# EAGLE design emonTH V1.4 (EAGLE 6.5.0)
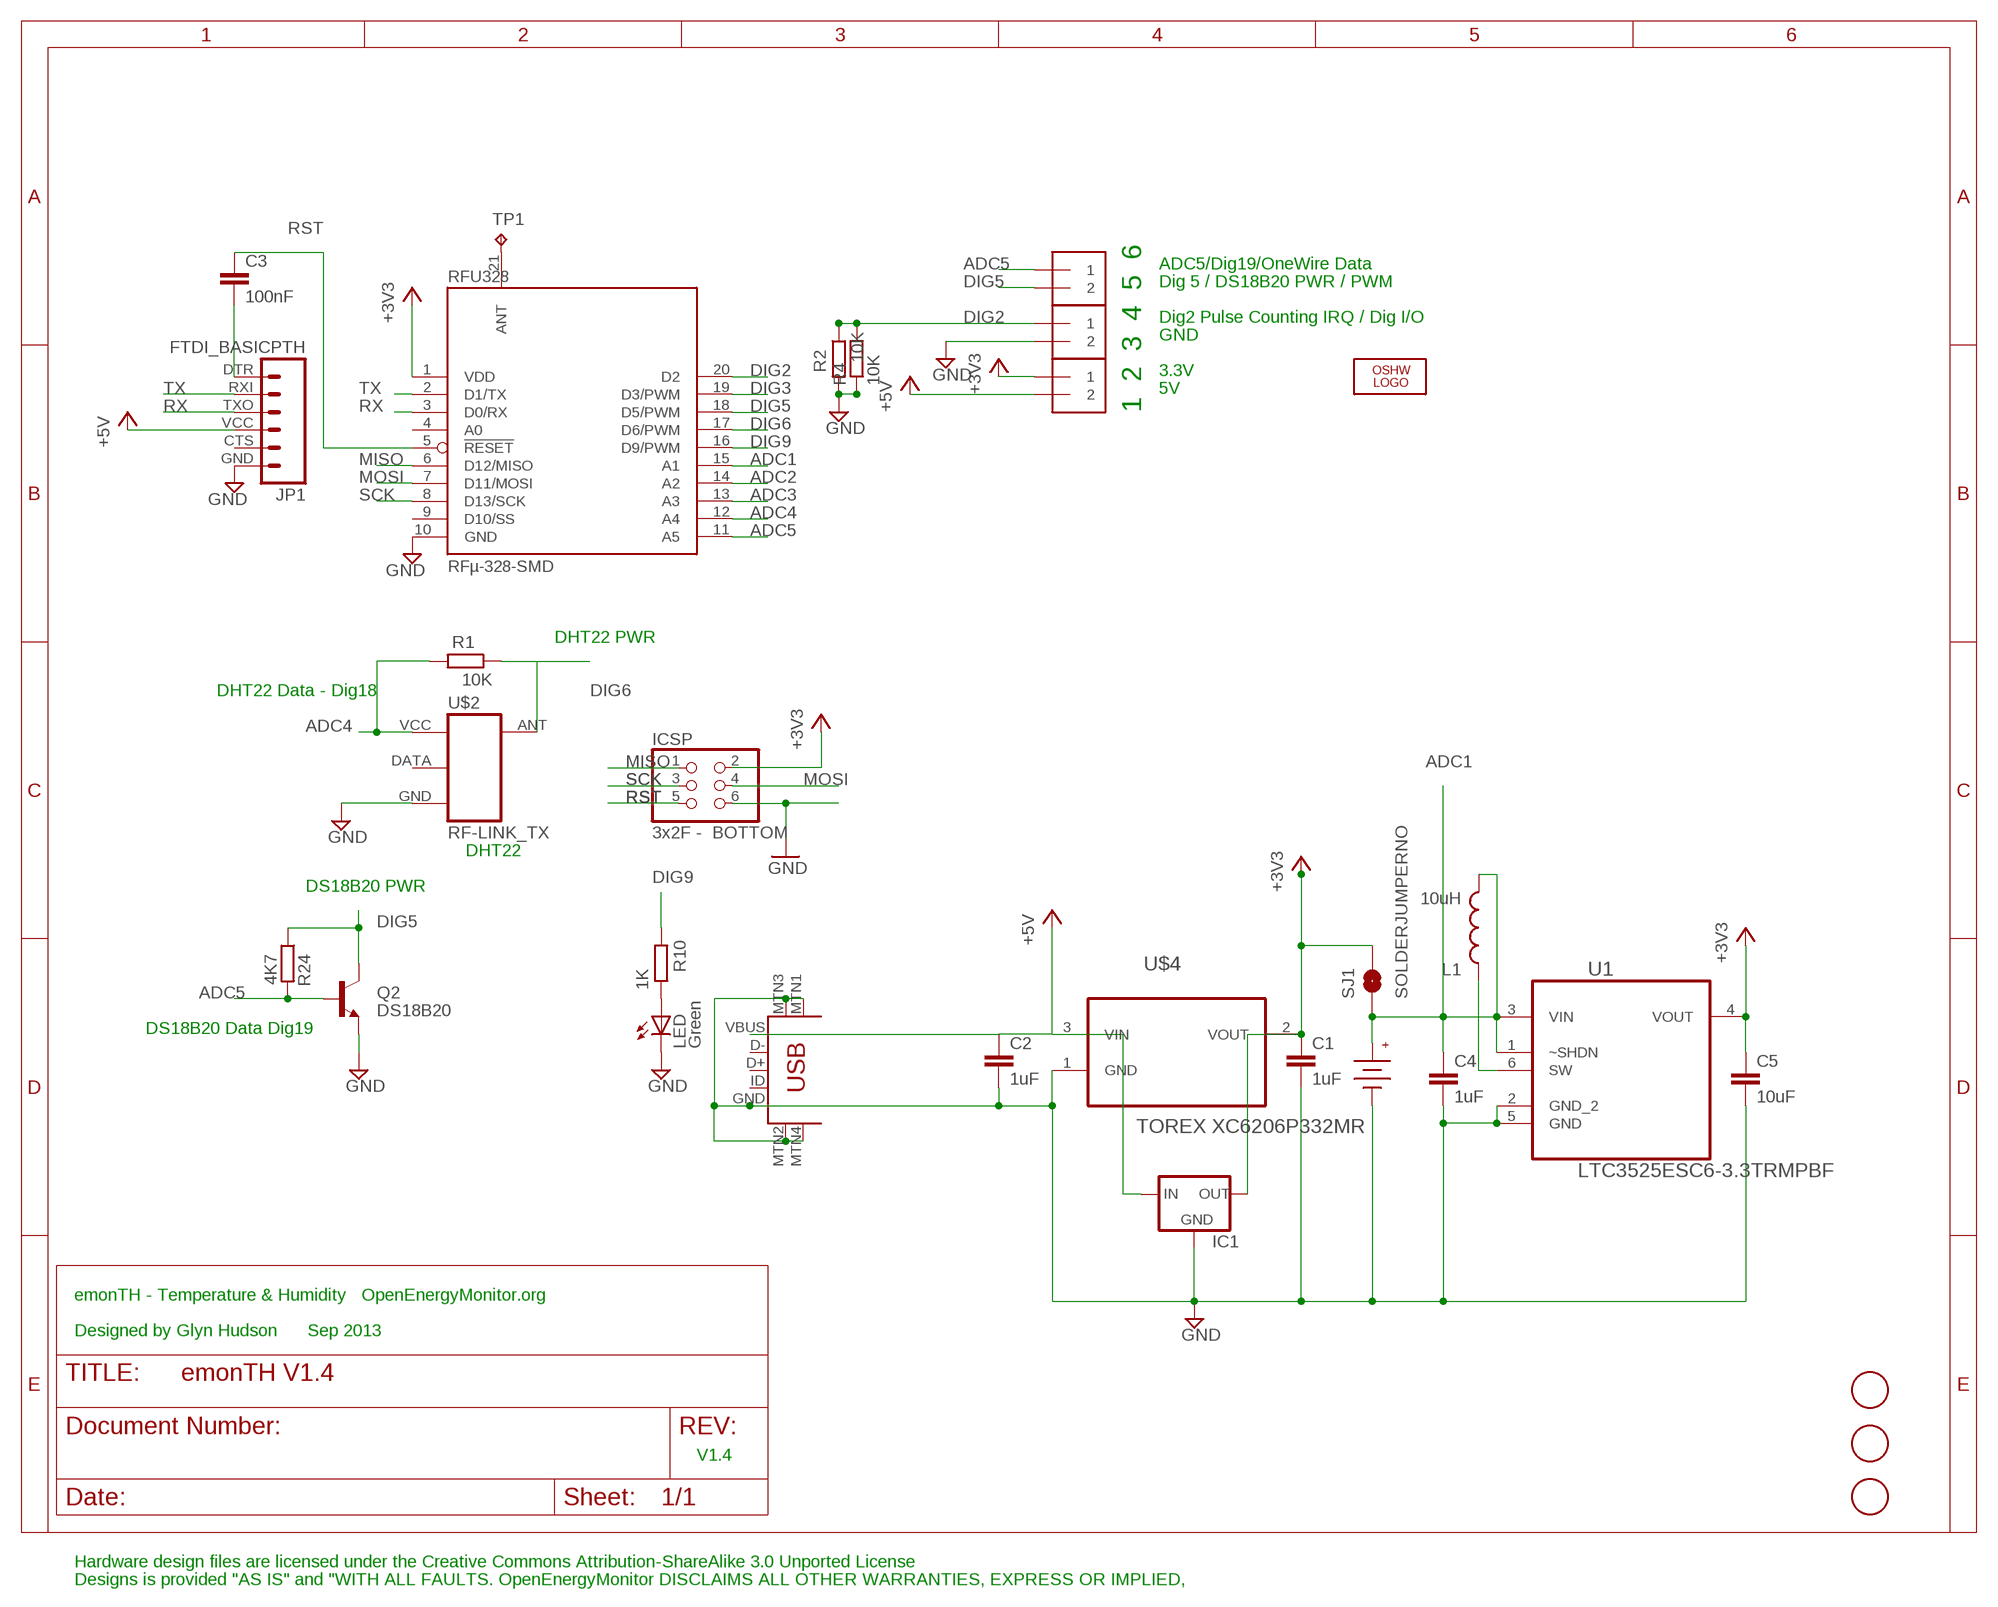
[diagram p0: schematic, sheet 1]

## Parts
C1  1uF  C-EUC0603  [C0603]
C2  1uF  C-EUC0603  [C0603]
C3  100nF  C-EUC0603  [C0603]
C4  1uF  C-EUC0603  [C0603]
C5  10uF  C-EUC0603  [C0603]
IC1  78XXS  [78XXS]
ICSP  3x2F - BOTTOM  PINHD-2X3  [2X03]
J1  1X2-3.5MM  [1X2-3.5MM]
J2  1X2-3.5MM  [1X2-3.5MM]
J3  1X2-3.5MM  [1X2-3.5MM]
JP1  FTDI_BASICPTH  [FTDI_BASIC]
L1  10uH  INDUCTOR1210  [1210]
LED  Green  LEDCHIP-LED0805  [CHIP-LED0805]
LOGO1  OSHW_LOGO_10MILX0200-NT  [OSHW_10X200_NOTEXT]
Q2  DS18B20  TRANSISTOR_NPNTO92  [TO-92]
R1  10K  R-EU_R0603  [R0603]
R2  10K  R-EU_R0603  [R0603]
R4  10K  R-EU_0204/7  [0204/7]
R10  1K  R-EU_R0603  [R0603]
R24  4K7  R-EU_R0603  [R0603]
RFU328  RFµ-328-SMD  [RFµ-328-LANDING]
SJ1  SOLDERJUMPERNO  [SJ_2S-NO]
TP1  TPPAD1-20  [P1-20]
U1  LTC3525ESC6-3.3TRMPBF  [SOT65P210X100-6N]
U$1  FIDUCIAL  [FIDUCIAL_1MM]
U$2  RF-LINK_TX  [RF-LINK_TX]
U$3  3V  3X_AAA_BATTERY_HOLDER  [AAA_PCB_HOLDER]
U$4  TOREX XC6206P332MR  MCP1700T-3302E/TT  [SOT95P237X112-3N]
U$5  USB-MINIB-5PIN  [USB-MINIB-CISECO]
U$6  FIDUCIAL  [FIDUCIAL_1MM]
U$7  FIDUCIAL  [FIDUCIAL_1MM]

## Nets
+3V3: C1.1 C5.1 IC1.OUT ICSP.2 J3.1 RFU328.1(VDD) SJ1.2 U1.4(VOUT) U$4.2(VOUT)
+5V [power]: C2.1 IC1.IN J3.2 JP1.VCC U$4.3(VIN) U$5.VBUS
ADC1: C4.1 L1.2 RFU328.15(A1) SJ1.1 U1.1(~SHDN) U1.3(VIN) U$3.+
ADC2: RFU328.14(A2)
ADC3: RFU328.13(A3)
ADC4: R1.2 RFU328.12(A4) U$2.VCC(+5V)
ADC5: J1.1 Q2.2(B) R24.2 RFU328.11(A5)
DIG2: J2.1 R2.1 R4.2 RFU328.20(D2)
DIG3: RFU328.19(D3/PWM)
DIG5: J1.2 Q2.3(C) R24.1 RFU328.18(D5/PWM)
DIG6: R1.1 RFU328.17(D6/PWM) U$2.ANT
DIG9: R10.2 RFU328.16(D9/PWM)
GND [gnd]: C1.2 C2.2 C4.2 C5.2 IC1.GND ICSP.6 J2.2 JP1.GND LED.C Q2.1(E) R2.2 R4.1 RFU328.10(GND) U1.2(GND_2) U1.5(GND) U$2.GND U$3.- U$4.1(GND) U$5.GND U$5.MTN1(MTN2) U$5.MTN2(MTN3) U$5.MTN3(MTN1) U$5.MTN4
MISO: ICSP.1 RFU328.6(D12/MISO)
MOSI: ICSP.4 RFU328.7(D11/MOSI)
N$1: RFU328.21(ANT) TP1.TP
N$2: C3.2 JP1.DTR
N$5: L1.1 U1.6(SW)
N$41: LED.A R10.1
RST: C3.1 ICSP.5 RFU328.5(!RESET)
RX: JP1.TXO RFU328.3(D0/RX)
SCK: ICSP.3 RFU328.8(D13/SCK)
TX: JP1.RXI RFU328.2(D1/TX)
Unconnected: JP1.CTS RFU328.4(A0) RFU328.9(D10/SS) U$2.DATA U$5.D+ U$5.D- U$5.ID

## Notes on the sheet
- ADC5/Dig19/OneWire Data
- Dig 5 / DS18B20 PWR / PWM
- Dig2 Pulse Counting IRQ / Dig I/O
- GND
- 3.3V
- 5V
- 1  2  3  4  5  6
- DHT22 PWR
- DHT22 Data - Dig18
- DHT22
- DS18B20 PWR
- DS18B20 Data Dig19
- emonTH - Temperature & Humidity   OpenEnergyMonitor.org
- Designed by Glyn Hudson      Sep 2013
- V1.4
- Hardware design files are licensed under the Creative Commons Attribution-ShareAlike 3.0 Unported License
- Designs is provided "AS IS" and "WITH ALL FAULTS. OpenEnergyMonitor DISCLAIMS ALL OTHER WARRANTIES, EXPRESS OR IMPLIED,

## Library data of the parts
C1-C5 = resistor:C-EU: CAPACITOR, European symbol
IC1 = v-reg:78XXS: VOLTAGE REGULATOR
ICSP = pinhead:PINHD-2X3: PIN HEADER
J1-J3 = adafruit:1X2: 3.5mm Terminal block http://www.ladyada.net/library/pcb/eaglelibrary.html
JP1 = SparkFun:FTDI_BASIC: FTDI Basic: 3.3V and 5V
L1 = SparkFun:INDUCTOR: Inductors Basic Inductor/Choke - 0603 and 1206. Footprints are not proven and vary greatly between part numbers.
LED = adafruit:LED: LED OSRAM: - CHIPLED LG R971, LG N971, LY N971, LG Q971, LY Q971, LO R971, LY R971 LH N974, LH R974 LS Q976, LO Q976, LY Q976 LO Q996 - Hyper CHIPLED LW Q18S LB Q993, LB Q99A, LB R99A - SideLED LS A670, LO A670, LY A670, LG A670, LP A670 LB A673, LV A673, LT A673, LW A673 LH A674 LY A675 LS A676, LA A676, LO A676, LY A676, LW A676 LS A679, LY A679, LG A679 - Hyper Micro SIDELED® LS Y876, LA Y876, LO Y876, LY Y876 LT Y87S - SmartLED LW L88C, LW L88S LB L89C, LB L89S, LG L890 LS L89K, LO L89K, LY L89K LS L896, LA L896, LO L896, LY L896 - TOPLED LS T670, LO T670, LY T670, LG T670, LP T670 LSG T670, LSP T670, LSY T670, LOP T670, LYG T670 LG T671, LOG T671, LSG T671 LB T673, LV T673, LT T673, LW T673 LH T674 LS T676, LA T676, LO T676, LY T676, LB T676, LH T676, LSB T676, LW T676 LB T67C, LV T67C, LT T67C, LS T67K, LO T67K, LY T67K, LW E67C LS E67B, LA E67B, LO E67B, LY E67B, LB E67C, LV E67C, LT E67C LW T67C LS T679, LY T679, LG T679 LS T770, LO T770, LY T770, LG T770, LP T770 LB T773, LV T773, LT T773, LW T773 LH T774 LS E675, LA E675, LY E675, LS T675 LS T776, LA T776, LO T776, LY T776, LB T776 LHGB T686 LT T68C, LB T68C - Hyper Mini TOPLED® LB M676 - Mini TOPLED Santana® LG M470 LS M47K, LO M47K, LY M47K Source: http://www.osram.convergy.de/
LOGO1 = ohw-logo:OSHW_LOGO_10MIL
Q2 = SparkFun:TRANSISTOR_NPN: Transistor NPN BJT configuration in SOT23 package. MMBT2222 is the common NPN we use. Double check BCE configuration again layout.
R1 R2 R10 R24 = resistor:R-EU_: RESISTOR, European symbol
R4 = rcl:R-EU_: RESISTOR, European symbol
RFU328 = Ciseco Footprints:RFµ-328-SMD
SJ1 = SparkFun:SOLDERJUMPER: Solder Jumper Standard SMD solder jumper. Used to automate production. Two varients : Normally Open and Normally Closed are the same, but have different paste layers. NC will have a large amount of paste and should jumper during reflow.
TP1 = testpad:TP: Test pad
U1 = LTC3525:LTC3525ESC6-3.3TRMPBF: Step-Up DC/DC Converter; MPN: LTC3525ESC6-3.3#TRMPBF; OC_FARNELL: 1663904; OC_NEWARK: 19P0692; PACKAGE: SC70-6; SUPPLIER: LINEAR TECHNOLOGY
U$1 U$6 U$7 = adafruit:FIDUCIAL: For use by pick and place machines to calibrate the vision/machine, 1mm By microbuilder.eu
U$2 = SparkFun:RF-LINK_TX
U$3 = Battery Holders_2xAA:3X_AAA_BATTERY_HOLDER: 2x AA Battery Holder; RAPID_OC: 18-2967
U$4 = Farnell_MCP1700-SOT23:MCP1700T-3302E/TT: Low Quiescent Current LDO; MPN: MCP1700T-3302E/TT; OC_FARNELL: 1296592; OC_NEWARK: 88H9817; PACKAGE: SOT23-3; SUPPLIER: Microchip
U$5 = Ciseco USB miniB_Updated:USB-MINIB: Mini-USB "B" connector with 5th pin broken out. Created new symbol breaking out 5th "ID" pin in mini/micro USB connector spec. See: http://en.wikipedia.org/wiki/Mini_usb#Cables. Uses same footprint as 4-pin symbol. Also added pins to connect to mounting / shield pads if required (probably not generally needed as signals aren't shielded once they leave the connector). Modified by Ciseco for Rapid Part 24-0357

## Net classes
0 default: width 0.203 mm, drill 0.6 mm, clearance 0.203 mm
1 power: width 0.305 mm, drill 0.6 mm, clearance 0.254 mm
2 gnd: width 0.254 mm, drill 0.6 mm, clearance 0.254 mm

## Board
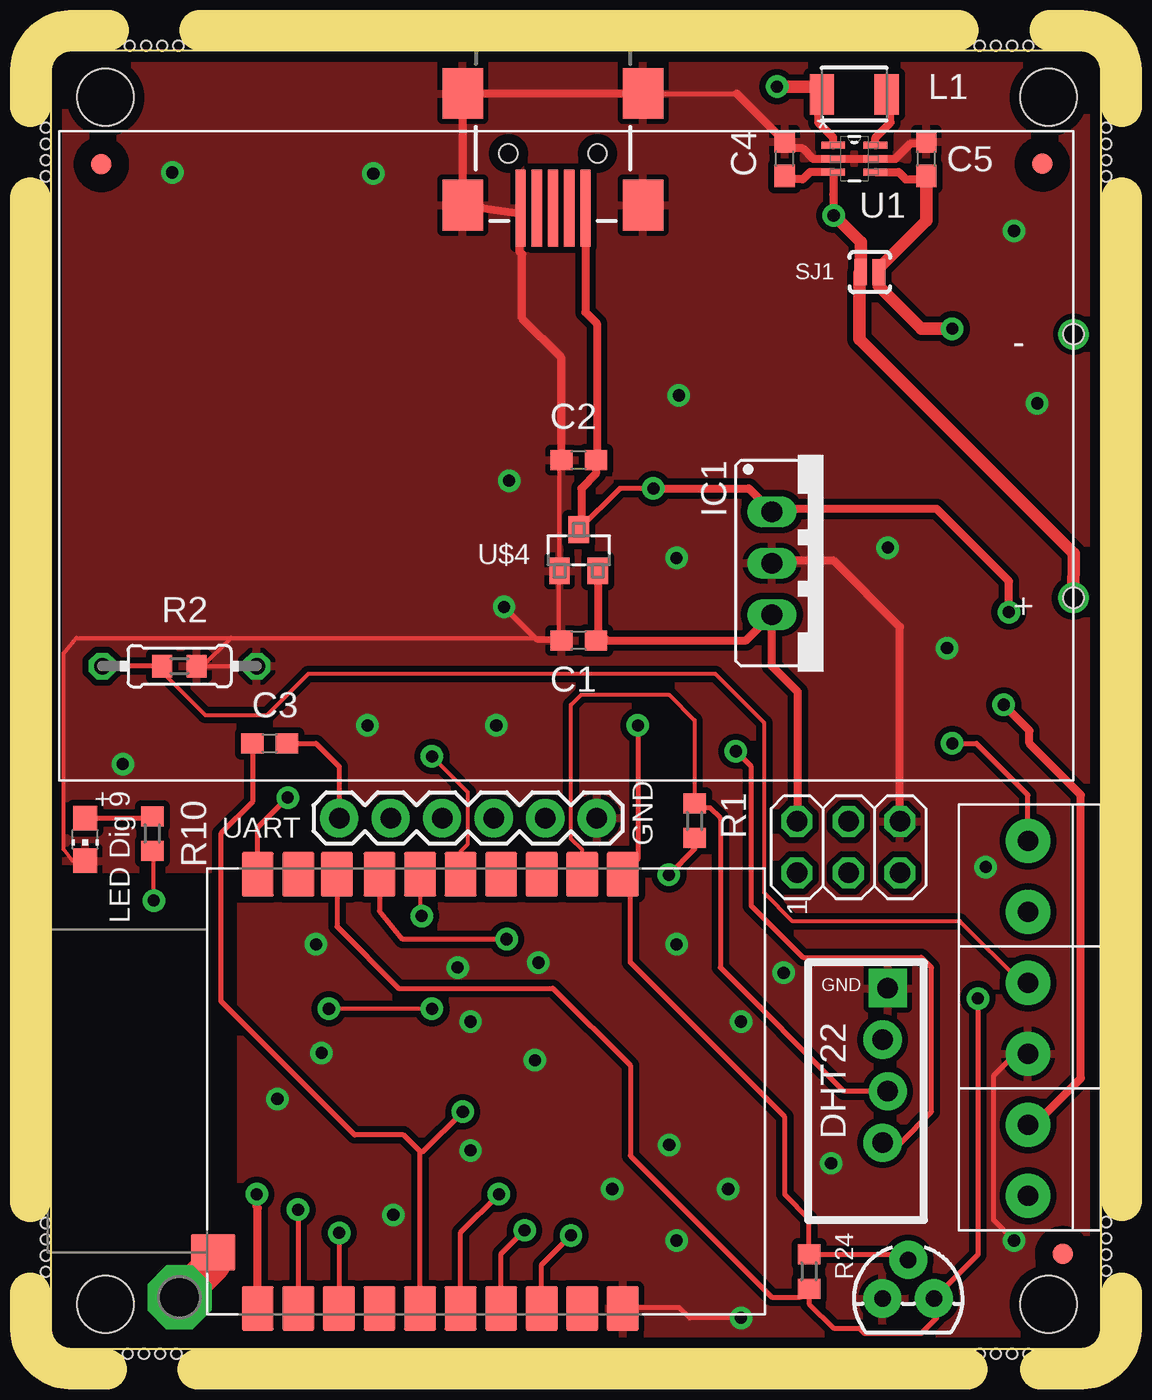
[diagram p1: board, top side]
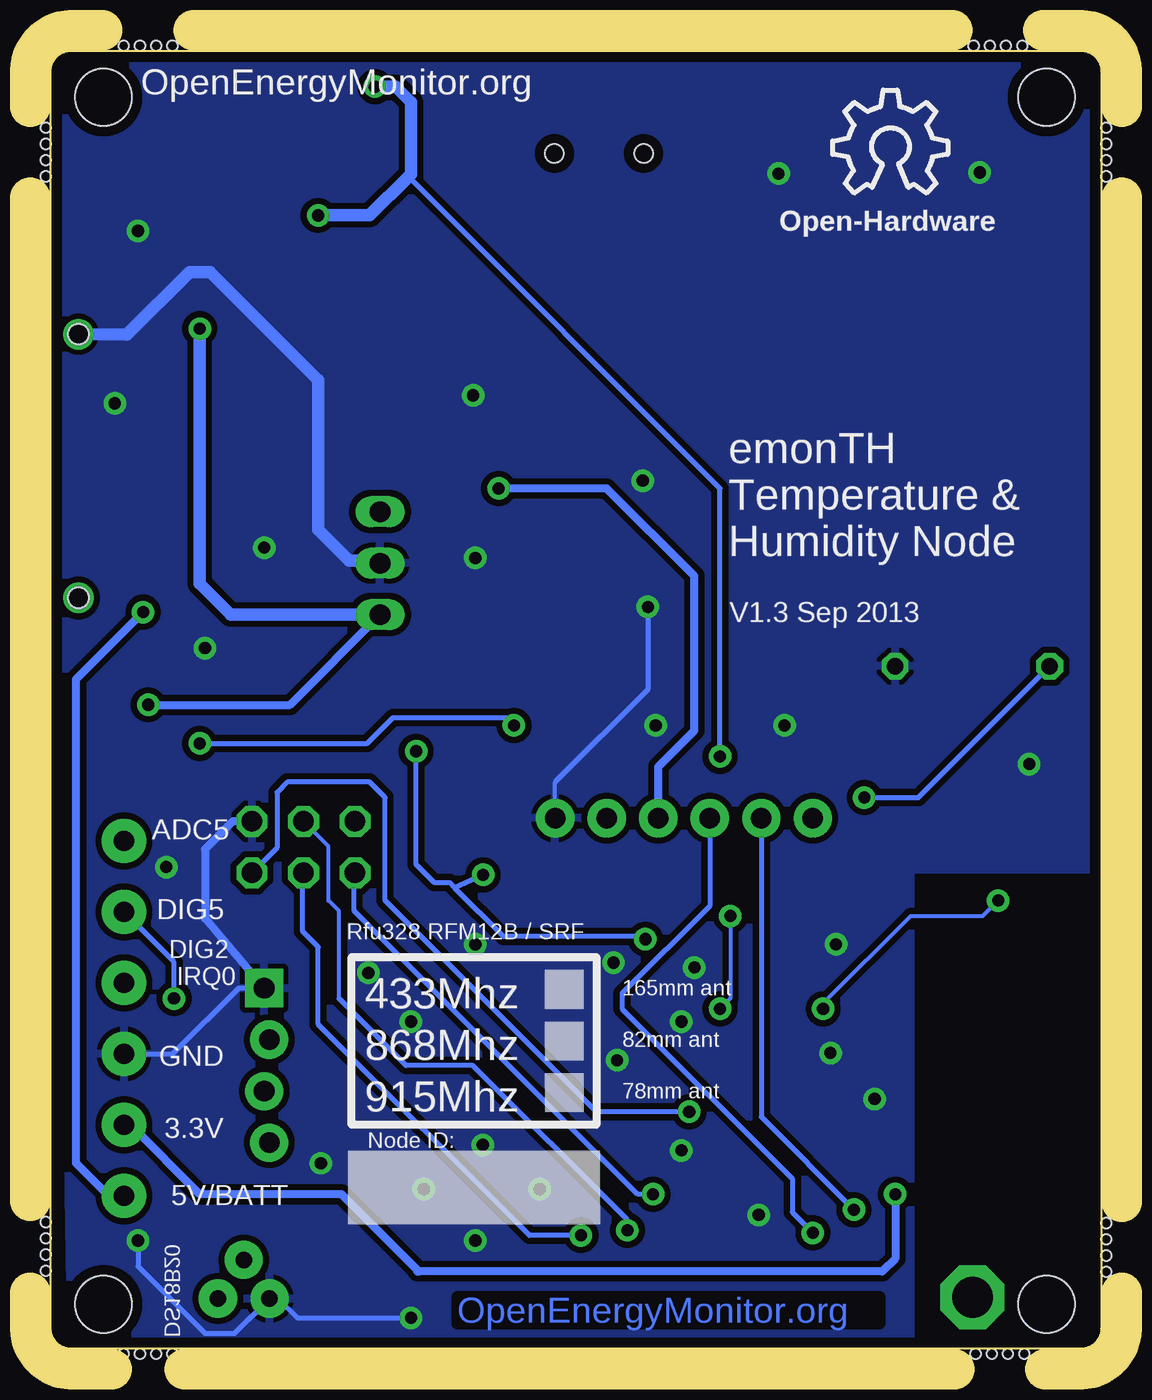
[diagram p2: board, bottom side, seen from below]

Size 51.8 x 64 mm. Coordinates in mm from the lower left corner, seen from the top.
Outline: 50.8,64 1,64 arc90 0,63 0,1 arc90 1,0 50.8,0 arc90 51.8,1 51.8,63 arc90 50.8,64
Copper layers (1*16): Top 0.035mm / dielectric 1.5mm / Bottom 0.035mm
Design rules "default": minimum track width 8mil, minimum drill 0.6mm, track to track 8mil, track to pad 10mil, pad to pad 10mil, via to via 10mil, smd to smd 10mil, copper to edge 20mil, drill to drill 16mil, minimum pad ring 10mil, minimum via ring 10mil, stop-mask expansion 0.075mm, vias tented up to drill 0.6mm, thermal gap 10mil
Holes 2.8 mm at 2.7,2.2 2.7,61.7 49.2,61.7 49.2,2.2
Holes 0.5 mm at 3.9,64.25 4.7,64.25 5.5,64.25 6.3,64.25 45.8,64.25 46.6,64.25 48.2,64.25 47.4,64.25 52.05,57.8 52.05,58.6 52.05,60.2 52.05,59.4 -0.25,57.8 -0.25,58.6 -0.25,60.2 -0.25,59.4 45.8,-0.25 46.6,-0.25 47.4,-0.25 48.2,-0.25 3.8,-0.25 4.6,-0.25 5.4,-0.25 6.2,-0.25 -0.25,3.8 -0.25,4.6 -0.25,5.4 -0.25,6.2 52.05,3.85 52.05,4.65 52.05,5.45 52.05,6.25
Milling: 16 lines

### Footprints (pad centres in the part's own frame; a part is rotated, then mirrored left to right if it is on the bottom)
C0603 = smd 1.1 x 1: 1 -0.85,0; 2 0.85,0
78XXS = drill 1.016 long: GND 0,-2.54; IN -2.54,-2.54; OUT 2.54,-2.54
2X03 = drill 1.016 octagon: 1 -2.54,-1.27; 2 -2.54,1.27; 3 0,-1.27; 4 0,1.27; 5 2.54,-1.27; 6 2.54,1.27
1X2-3.5MM = drill 1 pad 2.184: 1 1.8,0; 2 -1.7,0
FTDI_BASIC = drill 1.016 pad 1.88: CTS 10.16,0; DTR 0,0; GND 12.7,0; RXI 2.54,0; TXO 5.08,0; VCC 7.62,0
1210 = smd 1.2 x 2: 1 -1.6,0; 2 1.6,0
CHIP-LED0805 = smd 1.2 x 1.2: A 0,-1.05; C 0,1.05
TO-92 = drill 0.813 pad 1.88: 1 -1.27,0; 2 0,1.905; 3 1.27,0
R0603 = smd 1 x 1.1: 1 -0.85,0; 2 0.85,0
0204/7 = drill 0.813 octagon: 1 -3.81,0; 2 3.81,0
RFµ-328-LANDING = smd 2.2 x 1.6: 1 -10.7,20; 2 -10.7,18; 3 -10.7,16; 4 -10.7,14; 5 -10.7,12; 6 -10.7,10; 7 -10.7,8; 8 -10.7,6; 9 -10.7,4; 10 -10.7,2; 11 10.7,2; 12 10.7,4; 13 10.7,6; 14 10.7,8; 15 10.7,10; 16 10.7,12; 17 10.7,14; 18 10.7,16.1; 19 10.7,18; 20 10.7,20 | smd 1.8 x 2.2: 21 -7.93,22.2
SJ_2S-NO = smd 0.635 x 1.27: 1 -0.45,0; 2 0.45,0
P1-20 = drill 2.007 pad 3.15 octagon: TP 0,0
SOT65P210X100-6N = smd 1.168 x 0.356: 1 -1.041,0.66; 2 -1.041,0; 3 -1.041,-0.66; 4 1.041,-0.66; 5 1.041,0; 6 1.041,0.66
FIDUCIAL_1MM = smd 1 x 1: 1 0,0
RF-LINK_TX = drill 1.016 pad 1.88: ANT 7.62,-0.127; DATA 2.54,-0.127; VCC 5.08,0.127 | drill 1.016 pad 1.88 square: GND 0,0.127
AAA_PCB_HOLDER = drill 1: + 0,9; - 0,22 | hole 1: 0,9; 0,22
SOT95P237X112-3N = smd 0.991 x 1.321: 1 -0.94,-1.016; 2 0.94,-1.016; 3 0,1.016
USB-MINIB-CISECO = smd 3.8 x 0.5: D+ 7.9,0; D- 7.9,0.8; GND 7.9,-1.6; ID 7.9,-0.8; VBUS 7.9,1.6 | smd 2.5 x 2: MTN1 2.25,4.45; MTN2 7.75,4.45; MTN3 2.25,-4.45; MTN4 7.75,-4.45 | hole 0.9: 5.2,2.2; 5.2,-2.2

### Placement (x,y rotation side)
C1  26.04,34.92 180 top
C2  26.04,43.81 180 top
C3  10.79,29.84 0 top
C4  36.2,58.67 90 top
C5  43.18,58.67 90 top
IC1  38.1,38.73 270 top
ICSP  39.34,24.74 0 top
J1  48.18,23.24 90 top
J2  48.18,16.24 90 top
J3  48.18,9.24 90 top
JP1  14.22,26.16 0 top
L1  39.62,61.85 180 top
LED  1.7,25.11 180 top
LOGO1  13.23,56.98 0 bottom
Q2  42.28,2.48 0 top
R1  31.75,26.04 90 top
R2  6.35,33.66 0 top
R4  6.35,33.66 180 top
R10  5.01,25.4 270 top
R24  37.4,3.81 90 top
RFU328  30.21,12.69 90 top
SJ1  40.39,53.09 0 top
TP1  6.35,2.54 0 top
U1  39.62,58.67 0 top
U$1  49.9,4.68 0 top
U$2  41.15,17.78 270 top
U$3  50.43,28.02 0 top
U$4  26.04,39.37 0 top
U$5  24.77,64.14 270 top
U$6  2.5,58.4 0 top
U$7  48.9,58.42 0 top

### Tracks (layer width: path | path; a pad name or v marks a point on that pad's centre or on a via)
+3V3  (via drill 0.6)
  Top 0.254: 36.83,26.04 ICSP.2 | 43.01,57.66 C5.1 | SJ1.2 40.84,53.28
  Top 0.406: C1.1 27.43,34.92 | 27.43,34.92 34.29,34.92 IC1.OUT 35.56,33.66 36.83,32.38 36.83,26.04 | U$4.2 26.98,35.38 27.43,34.92 | v46.99,31.75 48.26,30.48 48.26,29.84 50.8,27.3 50.8,13.34 48.5,11.04 J3.1 | RFU328.1 10.21,6.93 10.16,6.99 v10.16,7.62 | U1.4 41.81,58.01 42.16,57.66 43.01,57.66
  Top 0.61: 40.84,53.28 43.18,55.63 C5.1 | SJ1.2 40.84,52.38 42.93,50.29 v44.45,50.29
  Bottom 0.406: v10.16,7.62 10.16,4.45 10.79,3.81 33.72,3.81 33.72,3.87 | 33.66,3.81 33.72,3.87 | 33.72,3.87 37.47,7.62 44.45,7.62 47.87,11.04 J3.1 | v46.99,31.75 40.01,31.75 IC1.OUT
  Bottom 0.61: IC1.OUT 42.93,36.2 44.45,37.72 v44.45,50.29
+5V  (via drill 0.6)
  Top 0.254: v29.72,42.42 28.07,42.42 U$4.3
  Top 0.406: U$5.VBUS 26.36,51.1 26.92,50.55 26.92,43.85 C2.1 26.89,43.14 26.16,42.42 26.16,40.51 U$4.3 | v47.24,36.32 47.24,37.85 43.69,41.4 35.69,41.4 IC1.IN 34.42,42.42 v29.72,42.42
  Bottom 0.406: JP1.VCC 21.84,28.7 20.07,30.48 20.07,38.1 24.38,42.42 v29.72,42.42 | J3.2 48.94,7.54 50.55,9.14 50.55,33.02 v47.24,36.32
ADC1  (via drill 0.6)
  Top 0.203: RFU328.15 20.21,24.53 20.57,24.89 20.57,27.43 v18.8,29.21
  Top 0.254: U1.1 38.46,59.33 | 37.85,61.16 37.59,61.42 L1.2 37.64,62.23 | 36.36,57.66 C4.1
  Top 0.406: U1.1 38.58,59.72 37.85,60.45 37.85,61.16 | 36.36,57.66 37.08,57.66 37.44,58.01 U1.3 38.58,56.92 v38.61,55.88
  Top 0.61: v35.81,62.23 37.64,62.23 | v38.61,55.88 39.94,54.55 SJ1.1 39.88,53.03 39.88,49.78 50.45,39.21 U$3.+
  Bottom 0.254: v18.8,29.21 18.8,42.42 34.16,57.78
  Bottom 0.61: v35.81,62.23 34.8,62.23 34.04,61.47 34.04,57.91 34.16,57.78 36.07,55.88 v38.61,55.88
ADC4
  Top 0.203: RFU328.12 26.21,24.59 25.65,25.15 25.65,31.75 26.16,32.26 30.48,32.26 31.75,30.99 R1.2
  Top 0.254: U$2.VCC 39.12,12.7 33.02,18.8 33.02,26.16 32.51,26.67 31.96,26.67 R1.2
ADC5  (via drill 0.6)
  Top 0.254: v28.96,30.73 28.96,24.14 RFU328.11 28.57,23.03 28.57,19.05 36.2,11.43 36.2,7.62 37.4,6.42 R24.2 42,4.66 Q2.2 | J1.1 48.18,27.3 45.64,29.84 v44.45,29.84
  Bottom 0.254: v44.45,29.84 36.2,29.84 34.92,31.11 29.34,31.11 v28.96,30.73
DIG2  (via drill 0.6)
  Top 0.203: R2.1 5.5,33.36 7.62,31.24 10.67,31.24 12.7,33.27 32.77,33.27 35.18,30.86 35.18,22.48 36.58,21.08 44.83,21.08 47.88,18.04 J2.1
  Top 0.254: R2.1 R4.2 | RFU328.20 10.21,25.7 v11.68,27.18
  Bottom 0.254: v11.68,27.18 9.02,27.18 R4.2
DIG5  (via drill 0.6)
  Top 0.254: RFU328.18 14.11,20.82 17.14,17.78 24.77,17.78 28.57,13.97 28.57,9.53 35.56,2.54 36.98,2.54 R24.1 37.4,2.23 38.61,1.02 39.88,1.02 40.13,0.76 42.93,0.76 43.69,1.52 43.69,2.34 Q2.3 45.72,4.64 v45.72,17.27
  Bottom 0.254: v45.72,17.27 45.72,19.07 J1.2
DIG6  (via drill 0.6)
  Top 0.254: RFU328.17 16.21,21.59 17.35,20.19 v22.48,20.19 | v33.78,29.46 34.54,28.7 34.54,21.84 37.08,19.3 42.93,19.3 43.43,18.8 43.43,11.68 41.91,10.16 U$2.ANT | R1.1 31.75,24.64 v30.48,23.37
  Bottom 0.254: v33.78,29.46 33.78,23.88 32.89,22.99 32.13,22.99 31.88,22.73 | 31.88,22.73 29.46,20.32 22.61,20.32 v22.48,20.19 | v30.48,23.37 31.88,22.73
DIG9  (via drill 0.6)
  Top 0.203: RFU328.16 18.21,21.67 v18.29,21.34 | v18.8,16.76 v13.72,16.76 | v5.08,22.1 5.08,24.48 R10.2
  Bottom 0.203: v18.29,21.34 18.29,17.27 v18.8,16.76 | v13.72,16.76 13.72,17.02 9.4,21.34 5.84,21.34 v5.08,22.1
GND  (via drill 0.6)
  Top 0.203: LED.C 1.09,24.06 0.64,24.64 0.64,34.29 1.27,35.05 8.89,35.05 | 8.89,35.05 25.06,35.05 | 25.06,35.05 C1.2 | 25.06,35.05 25.06,38.32 U$4.1 25.09,43.73 C2.2 | 43.27,59.44 C5.2 | R4.1 R2.2 7.49,33.66 8.89,35.05
  Top 0.254: v34.04,1.52 31.5,1.52 30.99,2.03 28.25,2.03 RFU328.10 | 36.28,59.44 C4.2 | 43.09,59.44 C5.2 | U$5.MTN1 33.83,61.88 | C1.2 24,34.92 v22.35,36.58 | J2.2 47.56,14.54 46.48,13.46 46.48,6.35 v47.5,5.33
  Top 0.406: C2.2 25.18,48.86 23.24,50.8 23.24,53.98 23.11,54.1 23.11,55.83 U$5.GND 23.07,55.98 U$5.MTN4 U$5.MTN3 U$5.MTN1 | ICSP.6 41.88,35.59 38.61,38.86 35.69,38.86 IC1.GND | 43.09,59.44 42.42,59.44 41.66,58.67 U1.5 U1.2 37.59,58.67 37.08,59.18 36.54,59.18 C4.2 33.83,61.88
  Bottom 0.203: JP1.GND 26.92,27.94
  Bottom 0.254: U$2.GND 42.55,17.78 45.79,14.54 J2.2 | v34.04,1.52 39.62,1.52 40.58,2.48 Q2.1 42.73,0.76 44.2,0.76 47.5,4.06 v47.5,5.33 | v22.35,36.58 22.35,32.51 26.92,27.94
  Bottom 0.406: ICSP.6 42.83,26.01 44.2,24.64 44.2,21.21 U$2.GND
  Bottom 0.61: IC1.GND 35.69,38.86 37.08,38.86 38.61,40.39 38.61,47.75 43.94,53.09 44.96,53.09 48.04,50 U$3.-
  other vias: 47.5,55.12 30.86,5.33 27.69,7.87 20.7,9.78 23.88,14.22 13.35,14.59 13.08,19.94 20.07,18.8 20.7,16.13 24.05,19.03 30.5,10.05 33.4,7.87 34.04,16.13 36.14,18.53 30.86,19.94 38.48,9.14 46.1,23.75 3.56,28.83 5.99,58 15.91,57.94 30.97,47.01 22.61,42.8 30.86,38.99 44.2,34.54 41.27,39.5 48.64,46.61 15.62,30.73 21.97,30.73 11.18,12.32 16.89,6.6
  pour Bottom (isolate 0.305): 0,23.62 0,63.01 arc-90 1,64.01 50.82,64.01 arc-90 51.82,63.01 50.82,0 9.4,0 9.4,23.62
  pour Top (isolate 0.305): 0,23.62 0,63.01 arc-90 1,64.01 50.82,64.01 arc-90 51.82,63.01 51.82,1 arc-90 50.82,0 9.4,0 9.4,23.62
MISO  (via drill 0.6)
  Top 0.254: RFU328.6 20.21,5.73 v22.1,7.62
  Bottom 0.254: v22.1,7.62 22.86,7.62 36.83,21.59 36.83,23.43 ICSP.1
MOSI  (via drill 0.6)
  Top 0.254: RFU328.7 22.21,4.68 v23.37,5.84
  Bottom 0.203: 37.59,17.27 37.59,21.59 38.1,22.1 38.1,24.77 ICSP.4
  Bottom 0.254: v23.37,5.84 23.37,6.35 30.99,13.97 34.29,13.97 37.59,17.27
N$1
  Top 1.778: RFU328.21 8.01,4.2 TP1.TP
N$2
  Top 0.254: C3.2 13.08,29.84 14.22,28.7 JP1.DTR
N$5
  Top 0.254: 41.4,61.67 L1.1
  Top 0.406: U1.6 40.66,59.72 41.4,60.45 41.4,61.67
N$41
  Top 0.254: 4.84,26.42 R10.1 4.92,26.16 LED.A
RST  (via drill 0.6)
  Top 0.254: RFU328.5 18.21,9.73 | 18.21,9.73 17.4,10.54 14.99,10.54 8.38,17.14 8.38,25.4 9.95,26.96 C3.1 | 18.21,9.73 18.37,9.73 v20.32,11.68
  Bottom 0.254: v20.32,11.68 24.89,11.68 35.31,22.1 35.31,27.18 36.07,27.94 40.13,27.94 40.64,27.43 40.64,24.7 ICSP.5
RX  (via drill 0.6)
  Top 0.254: v14.22,5.71 14.22,2.01 RFU328.3
  Bottom 0.254: JP1.TXO 19.3,21.84 23.62,17.53 23.62,16.76 15.24,8.38 15.24,6.73 v14.22,5.71
SCK  (via drill 0.6)
  Top 0.254: RFU328.8 24.21,4.14 v25.65,5.59
  Bottom 0.254: v25.65,5.59 28.19,5.59 38.61,16 38.61,19.81 39.37,20.57 39.37,23.43 ICSP.3
TX  (via drill 0.6)
  Top 0.254: v12.19,6.86 12.19,2.01 RFU328.2
  Bottom 0.254: JP1.RXI 16.76,11.43 v12.19,6.86

### Text on the board
Bottom: OpenEnergyMonitor.org
tPlace: LED Dig 9 | UART | GND | 1 | GND | DHT22
bPlace: emonTH / Temperature & / Humidity Node | V1.3 Sep 2013 | ADC5 | DIG5 | DIG2 / IRQ0 | GND | 3.3V | 5V/BATT
bNames: OpenEnergyMonitor.org | Open-Hardware | Rfu328 RFM12B / SRF | 165mm ant | 433Mhz | 82mm ant | 868Mhz | 78mm ant | 915Mhz | Node ID: | DS18B20
tSilk: emonTH | Direct battery / connection EN | OpenEnergyMonitor.org | Temperature & / Humidity Node | Designed in | North Wales | Made in UK | optional IRQ / pull down | 1 2 3 4 5 6
_tsilk: Designed in | North Wales | Made in UK
_bsilk: 165mm ant | 433Mhz | 165mm ant | 165mm ant | 433Mhz | 433Mhz | 868Mhz | 82mm ant | 82mm ant | 82mm ant | 868Mhz | 868Mhz | 78mm ant | 915Mhz | 78mm ant | 915Mhz | 78mm ant | 915Mhz | 165mm ant | 433Mhz | 82mm ant | 868Mhz | 78mm ant | 915Mhz
_tNames: L1 | C5 | C4 | U1 | SJ1 | C2 | IC1 | U$4 | R2 | C1 | C3 | R10 | R1 | R24